# Altium project Universal_PLC.PrjPcb (part 2 of 2)

## Sheet ANALOG_IOUTPUT.SchDoc
size A4; SheetNumber: 8; SheetTotal: 17
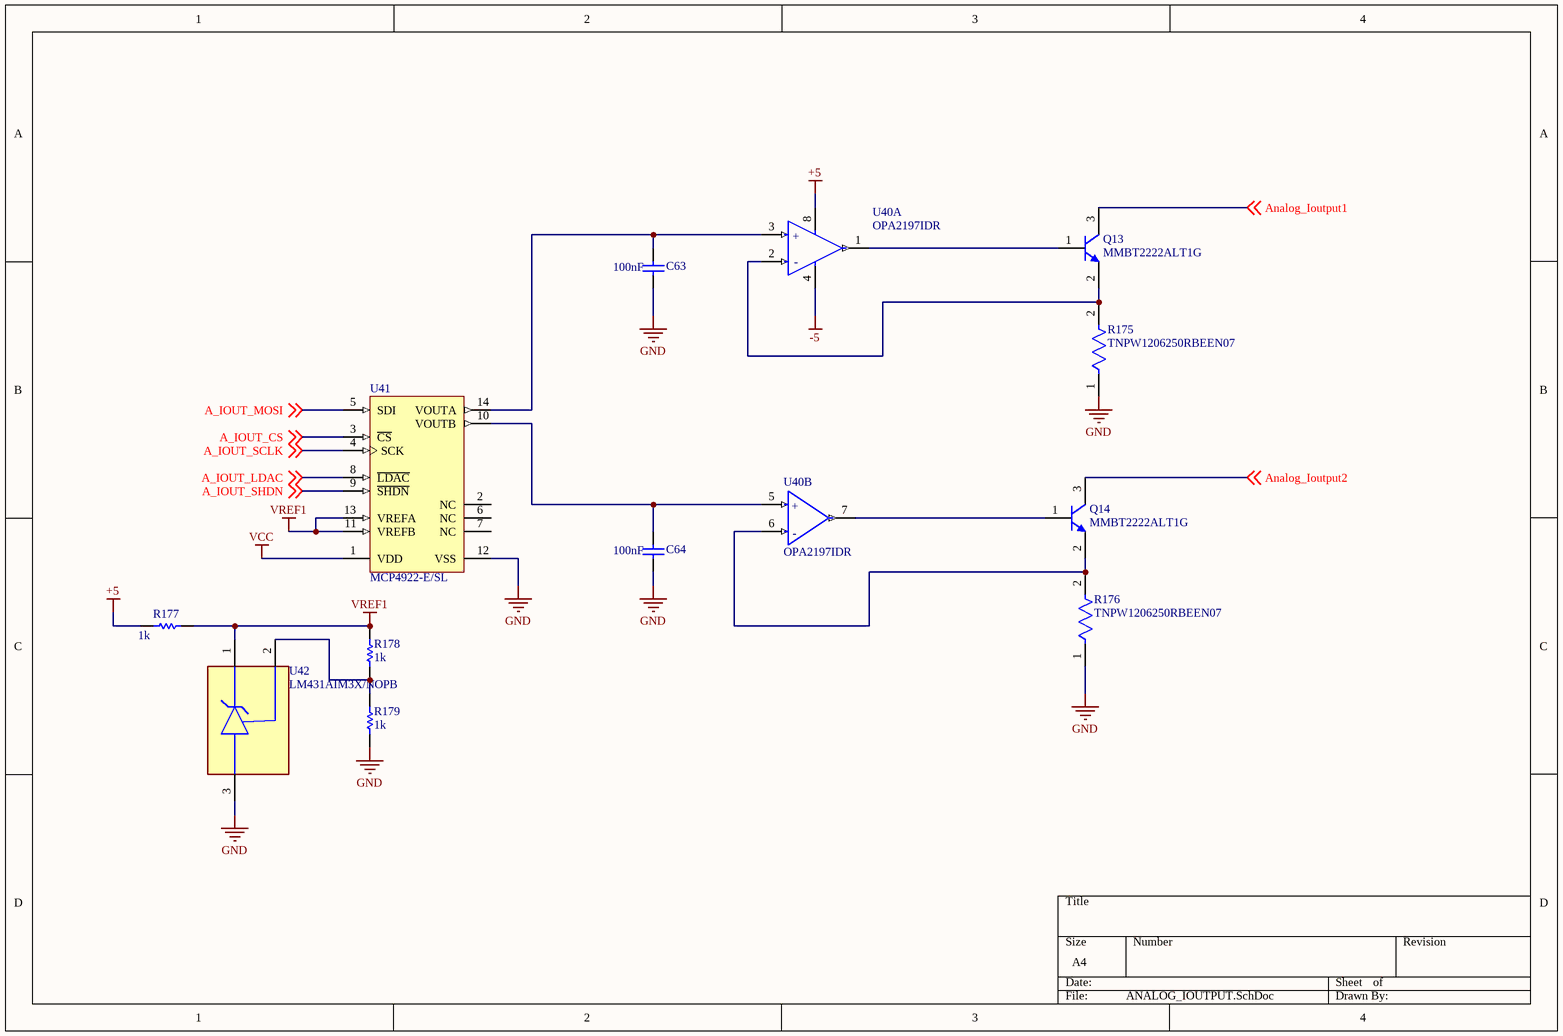
[diagram p5: ANALOG_IOUTPUT.SchDoc]

### Parts
C63  Capacitance: 100nF  [CAPC2013X135X45ML10T25]  (hidden comment: GRM21BR71H104KA01L)
C64  Capacitance: 100nF  [CAPC2013X135X45ML10T25]  (hidden comment: GRM21BR71H104KA01L)
Q13  MMBT2222ALT1G  [ONSC-SOT-23-3-318-08_V]
Q14  MMBT2222ALT1G  [ONSC-SOT-23-3-318-08_V]
R175  TNPW1206250RBEEN07  [FP-TNPW1206-e3-MFG]
R176  TNPW1206250RBEEN07  [FP-TNPW1206-e3-MFG]
R177  value 1k  [RESC2013X50X30NL20T20]  (hidden comment: CRCW08051K00FKTC)
R178  value 1k  [RESC2013X50X30NL20T20]  (hidden comment: CRCW08051K00FKTC)
R179  value 1k  [RESC2013X50X30NL20T20]  (hidden comment: CRCW08051K00FKTC)
U40  OPA2197IDR  [FP-D0008A-MFG]  (parts A,B of 2)
U41  MCP4922-E/SL  [SOIC-SL14_M]
U42  LM431AIM3X/NOPB  [FP-DBZ0003A-IPC_B]

### Nets
+5: R177.1 U40.8(V+)
-5: U40.4(V-)
GND: C63.1 C64.1 R175.1 R176.1 R179.1 U41.12(VSS) U42.3(A)
VCC: U41.1(VDD)
VREF1: R177.2 R178.2 U41.11(VREFB) U41.13(VREFA) U42.1(C)
A_IOUT_CS: U41.3(~{CS}) ; off-sheet A_IOUT_CS
A_IOUT_LDAC: U41.8(~{LDAC}) ; off-sheet A_IOUT_LDAC
A_IOUT_MOSI: U41.5(SDI) ; off-sheet A_IOUT_MOSI
A_IOUT_SCLK: U41.4(SCK) ; off-sheet A_IOUT_SCLK
A_IOUT_SHDN: U41.9(~{SHDN}) ; off-sheet A_IOUT_SHDN
Analog_Ioutput1: Q13.3(C) ; off-sheet Analog_Ioutput1
Analog_Ioutput2: Q14.3(C) ; off-sheet Analog_Ioutput2
NetC63_2: C63.2 U40.3(+IN_A) U41.14(VOUTA)
NetC64_2: C64.2 U40.5(+IN_B) U41.10(VOUTB)
NetQ13_1: Q13.1(B) U40.1(OUT_A)
NetQ13_2: Q13.2(E) R175.2 U40.2(-IN_A)
NetQ14_1: Q14.1(B) U40.7(OUT_B)
NetQ14_2: Q14.2(E) R176.2 U40.6(-IN_B)
NetR178_1: R178.1 R179.2 U42.2(REF)

Not connected (* = marked no-connect by the designer): U41 2(NC) 6(NC) 7(NC)

### Notes on the sheet
- (in symbol CMP-04895-000044-1, part A) +; -
- (in symbol CMP-04895-000044-1, part B) +; -

### Library data of the parts
C63 C64 = CMP-2100-03644-1: Chip Capacitor, 0.1 uF, +/- 10%, 50 V, -55 to 125 degC, 0805 (2012 Metric), RoHS, Tape and Reel; Manufacturer: Murata; Voltage: 50V; Insulation Resistance: 10GR; Dielectric Material: Ceramic; Dielectric: X7R; Package Description: 2-Pin Surface Mount Device, Body 2 x 1.25 mm; Manufacturer URL: http://www.murata.com/; Case Code (Imperial): 0805; Datasheet URL: http://psearch.en.murata.com/capacitor/product/GRM21BR71H104KA01%23.pdf; Termination: SMD/SMT; Lead Free: LeadFree; Package Quantity: 1; Mount: SurfaceMount; REACH SVHC: Unknown; Thickness: 0.053inch; Height: 1.25mm; Case/Package: 0805; Voltage Rating: 50V; Width: 0.049inch; Case Code (Metric): 2012; Material: Ceramic; Min Operating Temperature: -55degC; RoHSCompliant: true; Datasheet Version: 42675.0; Voltage Rating (DC): 50V; Tolerance: 10%; Package Reference: 0805; Depth: 1.25mm; Length: 2mm; Max Operating Temperature: 125degC; Packaging: TapeandReel; Number of Pins: 2; Radiation Hardening: No
Q13 Q14 = CMP-1048-00538-1: General Purpose Transistor, NPN Silicon, 3-Pin SOT-23, Pb-Free, Tape and Reel; Manufacturer: On Semiconductor; fT Min (MHz): 300; IC Continuous (A): 0.6; ComponentLink3URL: http://www.onsemi.cn/pub_link/Collateral/318-08.PDF; PartNumber: MMBT2222ALT1G; RoHS: TRUE; ComponentLink1URL: http://www.onsemi.com/; ComponentLink3Description: Package Specification; ComponentLink2Description: Datasheet; Mounting Technology: Surface Mount; Packing: Tape and Reel; PackageDescription: 3-Pin Small Outline Transistor, Body 2.92 x 1.3 mm, Pitch 0.95 mm; DatasheetVersion: Rev. 10; PackageReference: SOT-23-3-318-08; ComponentLink2URL: http://www.onsemi.cn/pub_link/Collateral/MMBT2222LT1-D.PDF; Polarity: NPN; PackageVersion: Rev. AP, 11/2009; ComponentLink1Description: Manufacturer URL
R175 R176 = CMP-02407-012799-1: Res Thnflm 1206 250R Ohm 0.1% 1/4W 25PPM/C SMD; Power Rating: 250mW; Temperature Coefficient: 25ppm/°C; Voltage Rating: 200V; Resistance: 250R; Length: 3.2mm; Package Quantity: 5000; Height: 0.55mm; Weight: 0.000571oz; Resistor Type: Thin Film; Tolerance: 0.1%; Packaging: Tape and Reel; Case/Package: 1206; Contact Plating: Tin; Min Operating Temperature: -55°C; Case Code (Imperial): 1206; Case Code (Metric): 3216; Width: 1.6mm; Termination: SMD/SMT; Series: TNPW e3; Max Operating Temperature: 125°C
R177-R179 = CMP-2001-04268-1: Manufacturer: Vishay Dale; Part Number: CRCW08051K00FKTC
U40 = CMP-04895-000044-1: IC OP AMP GP RR 10MHZ 8-SOIC; Manufacturer: Texas Instruments; Output Current Per Channel: 65mA; Min Supply Voltage: 4.5V; Input Offset Voltage: 0.025mV; Number Of Channels: 2; Voltage Gain: 134-143dB; Max Dual Supply Voltage: 18V; Min Dual Supply Voltage: 2.25V; Standoff Height: 0.11mm; Max Supply Voltage: 36V; Input Bias Current: 0.000005uA; Nominal Supply Current: 1mA; Max Junction Temp: +150°C; Temperature Range Low: -40°C; Package: D0008A; Temperature: -40°C to +125°C; Gain Bandwidth: 10MHz; Category: IC; Digikey Description: IC OP AMP GP RR 10MHZ 8-SOIC; Automotive: No; Height: 1.75mm; Ambient Temperature Range Low: -40°C; Device Class L3: Amplifiers - Op Amps; ComponentLink2URL: http://www.ti.com/lit/ds/symlink/opa2197.pdf; Lead Free: Yes; RoHS: TRUE; Manufacturer Part Number: OPA2197IDR; Device Class L1: Integrated Circuits (ICs); ComponentLink2Description: Datasheet; Ipc Land Pattern Name: SOIC127P600X175-8; Device Class L2: Linear ICs; Temperature Range High: +125°C; Octopart: https://octopart.com/opa2197idr-texas+instruments-75179702; Ambient Temperature Range High: +125°C
U41 = CMP-0188-00496-2: 12-Bit DAC with SPI Interface, 14-Pin SOIC 150mil, Extended Temperature; ComponentLink2Description: Datasheet; DatasheetVersion: revA, Apr-2010; RevisionNote: URLs added. DatasheetVersion updated. Sch updated.; Code_IPC: SOIC127P600-14; PackageVersion: revBB, Aug-2009; PackageReference: SOIC-SL14; ComponentLink3URL: http://www.microchip.com/stellent/groups/techpub_sg/documents/packagingspec/en012702.pdf; ComponentLink3Description: Package Specification; ComponentLink2URL: http://ww1.microchip.com/downloads/en/DeviceDoc/22250A.pdf; ComponentLink1URL: http://www.microchip.com/; Code_JEDEC: MS-012-AB; PackageDescription: 14-Lead Plastic Small Outline (SL) - Narrow, 3.90mm Body [SOIC]; ComponentLink1Description: Manufacturer URL
U42 = CMP-04916-000022-1: IC VREF SHUNT 37V 2.2% SOT23-3; Temperature Coefficient: 50ppm/°C; Tolerance: 2%; Max Output Current: 100mA; Cathode Current: 1mA; Number of Channels: 1; Radiation Hardening: No; Packaging: Tape and Reel; Package Quantity: 3000; Max Output Voltage: 37V; Max Input Voltage: 37V; Min Operating Temperature: -40°C; Case/Package: SOT-23; Lead Free: Lead Free; Number of Pins: 3; Output Current: 100mA; RoHS Compliant: Yes; Max Operating Temperature: 85°C; Reference Type: Shunt; Output Voltage: 37V; Mount: Surface Mount

## Sheet ANALOG_VOUTPUT.SchDoc
size A4; SheetNumber: 9; SheetTotal: 17
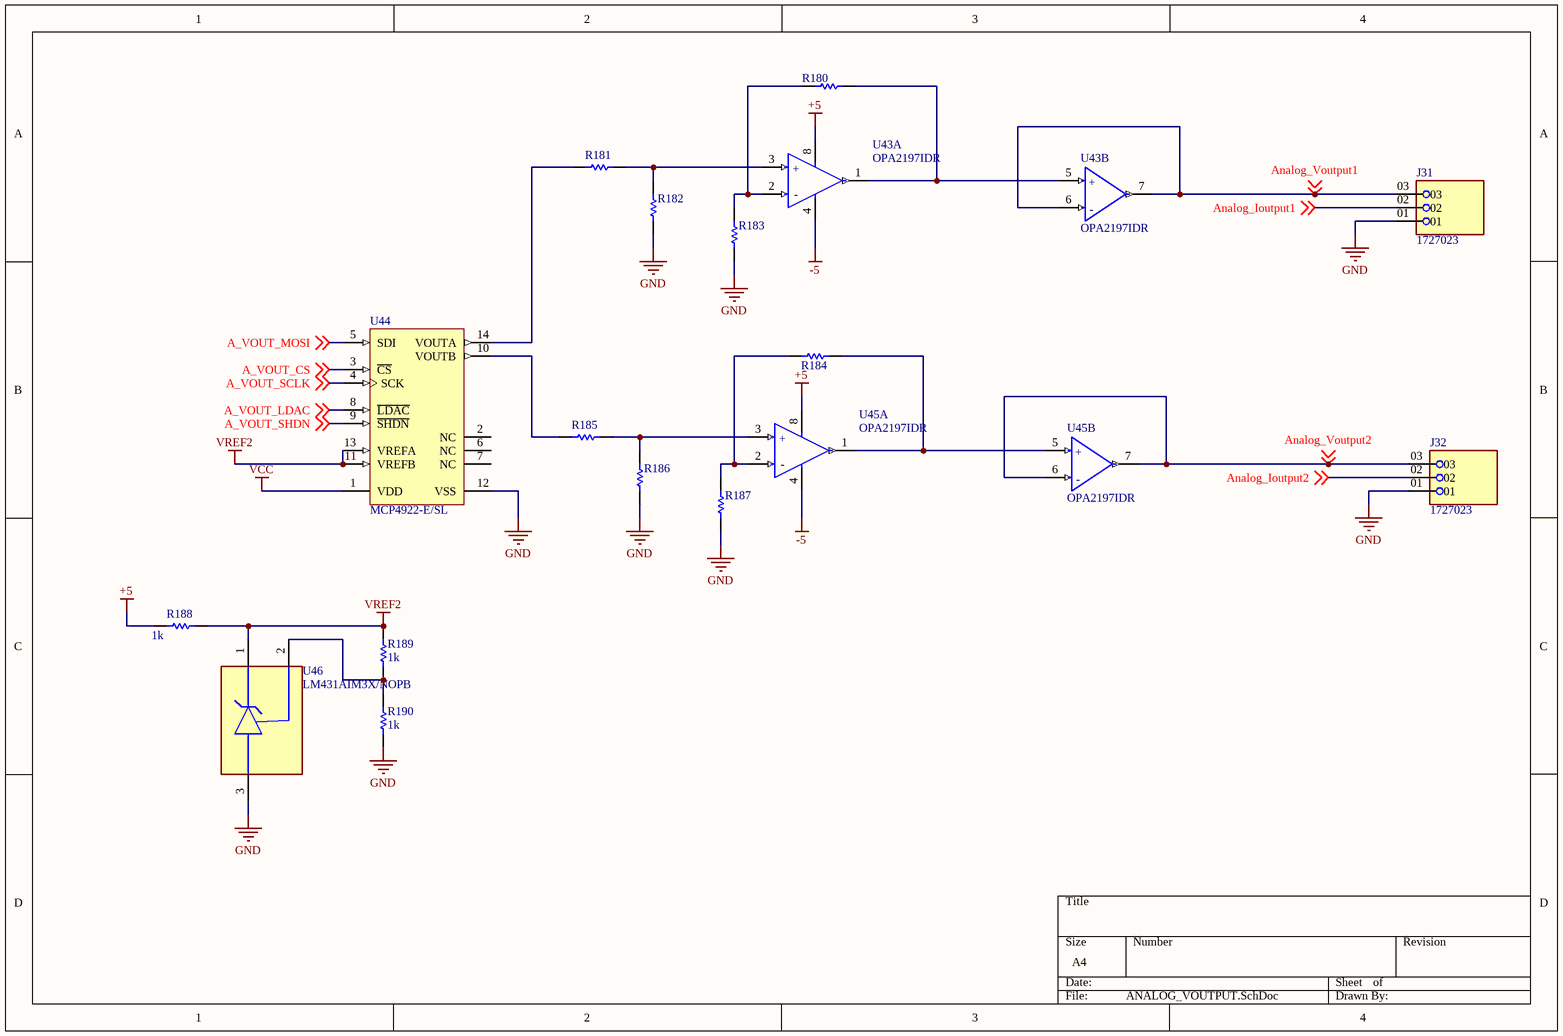
[diagram p6: ANALOG_VOUTPUT.SchDoc]

### Parts
J31  1727023  [PHOENIX_1727023]
J32  1727023  [PHOENIX_1727023]
R180  CRCW060310K0FKEA  [RESC1609X50X30NL8T20]  (value not drawn)
R181  CRCW060310K0FKEA  [RESC1609X50X30NL8T20]  (value not drawn)
R182  CRCW060310K0FKEA  [RESC1609X50X30NL8T20]  (value not drawn)
R183  CRCW060310K0FKEA  [RESC1609X50X30NL8T20]  (value not drawn)
R184  CRCW060310K0FKEA  [RESC1609X50X30NL8T20]  (value not drawn)
R185  CRCW060310K0FKEA  [RESC1609X50X30NL8T20]  (value not drawn)
R186  CRCW060310K0FKEA  [RESC1609X50X30NL8T20]  (value not drawn)
R187  CRCW060310K0FKEA  [RESC1609X50X30NL8T20]  (value not drawn)
R188  value 1k  [RESC2013X50X30NL20T20]  (hidden comment: CRCW08051K00FKTC)
R189  value 1k  [RESC2013X50X30NL20T20]  (hidden comment: CRCW08051K00FKTC)
R190  value 1k  [RESC2013X50X30NL20T20]  (hidden comment: CRCW08051K00FKTC)
U43  OPA2197IDR  [FP-D0008A-MFG]  (parts A,B of 2)
U44  MCP4922-E/SL  [SOIC-SL14_M]
U45  OPA2197IDR  [FP-D0008A-MFG]  (parts A,B of 2)
U46  LM431AIM3X/NOPB  [FP-DBZ0003A-IPC_B]

### Nets
+5: R188.1 U43.8(V+) U45.8(V+)
-5: U43.4(V-) U45.4(V-)
GND: J31.01 J32.01 R182.1 R183.1 R186.1 R187.1 R190.1 U44.12(VSS) U46.3(A)
VCC: U44.1(VDD)
VREF2: R188.2 R189.2 U44.11(VREFB) U44.13(VREFA) U46.1(C)
A_VOUT_CS: U44.3(~{CS}) ; off-sheet A_VOUT_CS
A_VOUT_LDAC: U44.8(~{LDAC}) ; off-sheet A_VOUT_LDAC
A_VOUT_MOSI: U44.5(SDI) ; off-sheet A_VOUT_MOSI
A_VOUT_SCLK: U44.4(SCK) ; off-sheet A_VOUT_SCLK
A_VOUT_SHDN: U44.9(~{SHDN}) ; off-sheet A_VOUT_SHDN
Analog_Ioutput1: J31.02 ; off-sheet Analog_Ioutput1
Analog_Ioutput2: J32.02 ; off-sheet Analog_Ioutput2
Analog_Voutput1: J31.03 U43.6(-IN_B) U43.7(OUT_B) ; off-sheet Analog_Voutput1
Analog_Voutput2: J32.03 U45.6(-IN_B) U45.7(OUT_B) ; off-sheet Analog_Voutput2
NetR180_1: R180.1 U43.1(OUT_A) U43.5(+IN_B)
NetR180_2: R180.2 R183.2 U43.2(-IN_A)
NetR181_1: R181.1 U44.14(VOUTA)
NetR181_2: R181.2 R182.2 U43.3(+IN_A)
NetR184_1: R184.1 U45.1(OUT_A) U45.5(+IN_B)
NetR184_2: R184.2 R187.2 U45.2(-IN_A)
NetR185_1: R185.1 U44.10(VOUTB)
NetR185_2: R185.2 R186.2 U45.3(+IN_A)
NetR189_1: R189.1 R190.2 U46.2(REF)

Not connected (* = marked no-connect by the designer): U44 2(NC) 6(NC) 7(NC)

### Notes on the sheet
- (in symbol CMP-04895-000044-1, part A) +; -
- (in symbol CMP-04895-000044-1, part B) +; -

### Library data of the parts
J31 J32 = 1727023: PCB Terminal Screw 3.81mm 16AWG 200V 13.5A 3 Position COMBICON MKDS Series | Phoenix Contact 1727023; SnapEDA_Link: https://www.snapeda.com/parts/1727023/Phoenix+Contact/view-part/?ref=snap; Package: None; Value: *; MF: Phoenix Contact; MP: 1727023; Check_prices: https://www.snapeda.com/parts/1727023/Phoenix+Contact/view-part/?ref=eda
R180-R187 = CMP-1666-00005-4: Chip Resistor, 10 KOhm, +/- 1%, 100 mW, -55 to 155 degC, 0603 (1608 Metric), RoHS, Tape and Reel; Manufacturer: Vishay Semiconductor; Voltage Rating: 75 V; Max Operating Temperature: 155 degC; PackageDescription: 2-Pin Surface Mount Device, Body 1.575 x 0.85 mm; ComponentLink1Description: Manufacturer URL; RoHSCompliant: true; PackageReference: 0603; REACH SVHC: Unknown; Length: 1.55 mm; DatasheetVersion: 06/2012; Packaging: Tape and Reel; Min Operating Temperature: -55 degC; Mounting Technology: Surface Mount; ComponentLink2URL: https://datasheet.ciiva.com/11809/0900766b80d98afc-11809037.pdf; Height: 0.45 mm; ComponentLink2Description: Datasheet; Package Quantity: 5000; ComponentLink1URL: http://www.vishay.com/
R188-R190 = CMP-2001-04268-1: Manufacturer: Vishay Dale; Part Number: CRCW08051K00FKTC
U43 U45 = CMP-04895-000044-1: as U40 on sheet ANALOG_IOUTPUT; Temperature Range Low: -40°C; Package: D0008A; Temperature: -40°C to +125°C; Gain Bandwidth: 10MHz; Category: IC; Digikey Description: IC OP AMP GP RR 10MHZ 8-SOIC; Automotive: No; Height: 1.75mm; Ambient Temperature Range Low: -40°C; Device Class L3: Amplifiers - Op Amps; ComponentLink2URL: http://www.ti.com/lit/ds/symlink/opa2197.pdf; Lead Free: Yes; RoHS: TRUE; Manufacturer Part Number: OPA2197IDR; Device Class L1: Integrated Circuits (ICs); ComponentLink2Description: Datasheet; Ipc Land Pattern Name: SOIC127P600X175-8; Device Class L2: Linear ICs; Temperature Range High: +125°C; Octopart: https://octopart.com/opa2197idr-texas+instruments-75179702; Ambient Temperature Range High: +125°C
U44 = CMP-0188-00496-2: as U41 on sheet ANALOG_IOUTPUT; ComponentLink2Description: Datasheet; DatasheetVersion: revA, Apr-2010; RevisionNote: URLs added. DatasheetVersion updated. Sch updated.; Code_IPC: SOIC127P600-14; PackageVersion: revBB, Aug-2009; PackageReference: SOIC-SL14; ComponentLink3URL: http://www.microchip.com/stellent/groups/techpub_sg/documents/packagingspec/en012702.pdf; ComponentLink3Description: Package Specification; ComponentLink2URL: http://ww1.microchip.com/downloads/en/DeviceDoc/22250A.pdf; ComponentLink1URL: http://www.microchip.com/; Code_JEDEC: MS-012-AB; PackageDescription: 14-Lead Plastic Small Outline (SL) - Narrow, 3.90mm Body [SOIC]; ComponentLink1Description: Manufacturer URL
U46 = CMP-04916-000022-1: as U42 on sheet ANALOG_IOUTPUT; Radiation Hardening: No; Packaging: Tape and Reel; Package Quantity: 3000; Max Output Voltage: 37V; Max Input Voltage: 37V; Min Operating Temperature: -40°C; Case/Package: SOT-23; Lead Free: Lead Free; Number of Pins: 3; Output Current: 100mA; RoHS Compliant: Yes; Max Operating Temperature: 85°C; Reference Type: Shunt; Output Voltage: 37V; Mount: Surface Mount

## Sheet Temp_sensors Input.SchDoc
size A4; SheetNumber: 10; SheetTotal: 16
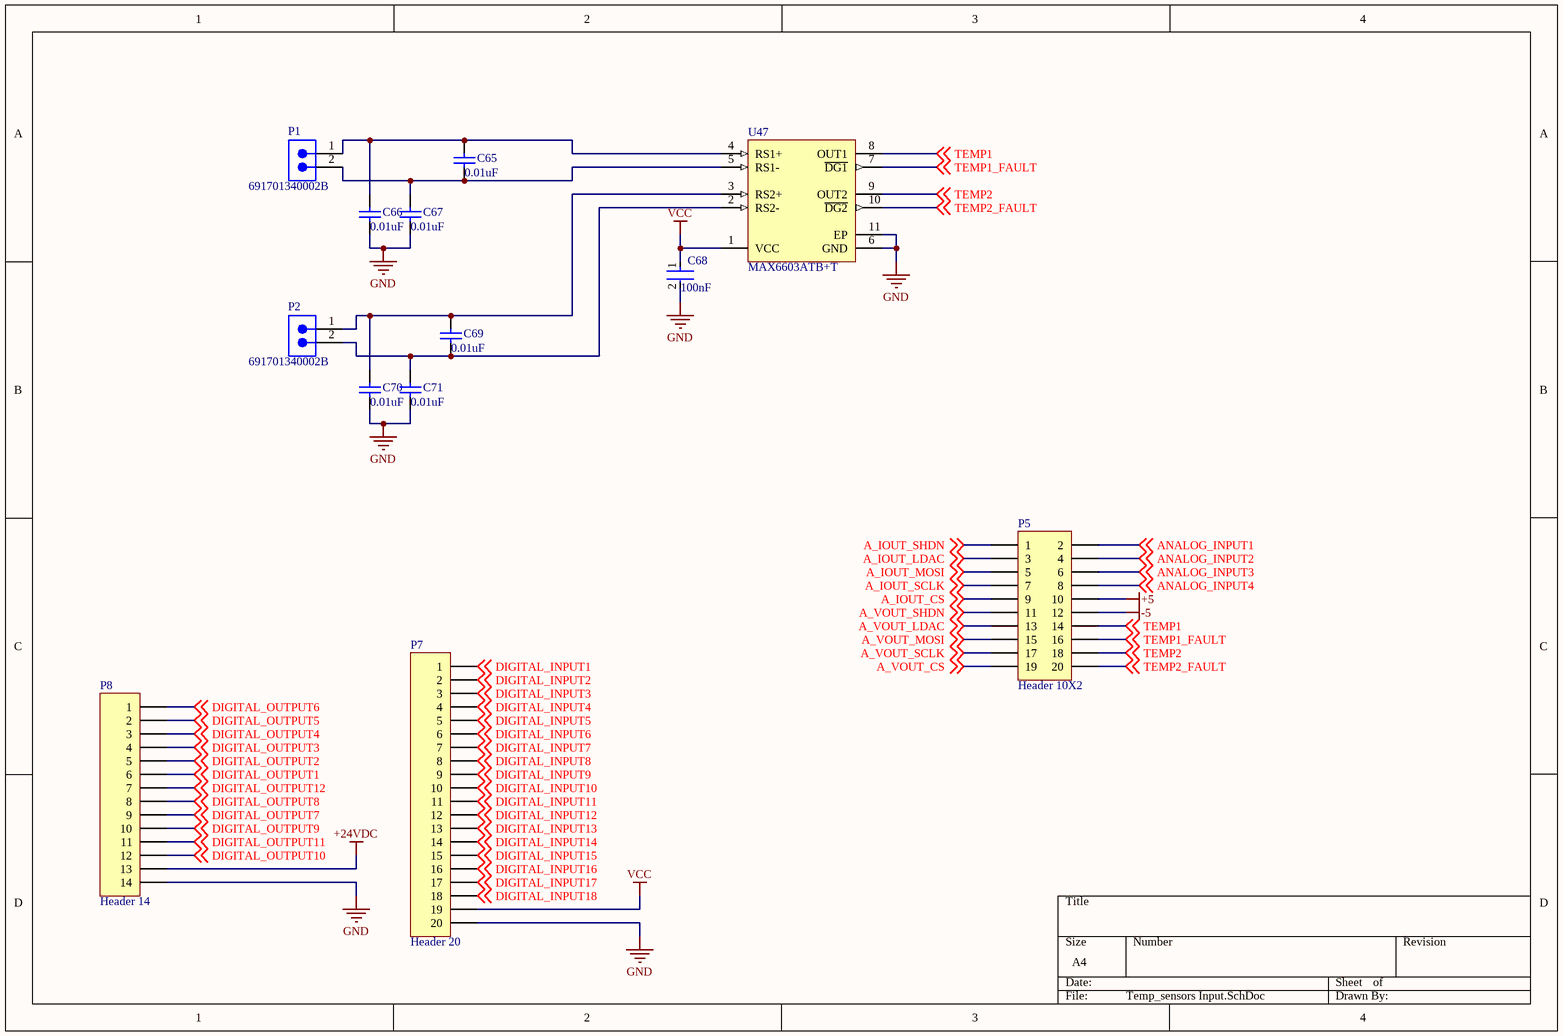
[diagram p7: Temp_sensors Input.SchDoc]

### Parts
C65  value 0.01uF  [CAPC1608X92X38ML15T08]  (hidden comment: VJ0603Y103KXAAP)
C66  value 0.01uF  [CAPC1608X92X38ML15T08]  (hidden comment: VJ0603Y103KXAAP)
C67  value 0.01uF  [CAPC1608X92X38ML15T08]  (hidden comment: VJ0603Y103KXAAP)
C68  Capacitance: 100nF  [FP-0805-L_2_01_0_2-W_1_25-IPC_B]  (hidden comment: 08051C104K4T2A)
C69  value 0.01uF  [CAPC1608X92X38ML15T08]  (hidden comment: VJ0603Y103KXAAP)
C70  value 0.01uF  [CAPC1608X92X38ML15T08]  (hidden comment: VJ0603Y103KXAAP)
C71  value 0.01uF  [CAPC1608X92X38ML15T08]  (hidden comment: VJ0603Y103KXAAP)
P1  691701340002B  [691701340002B]
P2  691701340002B  [691701340002B]
P5  Header 10X2  [HDR2X10]
P7  Header 20  [HDR1X20]
P8  Header 14  [HDR1X14]
U47  MAX6603ATB+T  [MAXM-T1033+1_V]

### Nets
+5: P5.10
+24VDC: P8.13
-5: P5.12
GND: C66.1 C67.1 C68.2 C70.1 C71.1 P7.20 P8.14 U47.6(GND) U47.11(EP)
VCC: C68.1 P7.19 U47.1(VCC)
A_IOUT_CS: P5.9 ; off-sheet A_IOUT_CS
A_IOUT_LDAC: P5.3 ; off-sheet A_IOUT_LDAC
A_IOUT_MOSI: P5.5 ; off-sheet A_IOUT_MOSI
A_IOUT_SCLK: P5.7 ; off-sheet A_IOUT_SCLK
A_IOUT_SHDN: P5.1 ; off-sheet A_IOUT_SHDN
A_VOUT_CS: P5.19 ; off-sheet A_VOUT_CS
A_VOUT_LDAC: P5.13 ; off-sheet A_VOUT_LDAC
A_VOUT_MOSI: P5.15 ; off-sheet A_VOUT_MOSI
A_VOUT_SCLK: P5.17 ; off-sheet A_VOUT_SCLK
A_VOUT_SHDN: P5.11 ; off-sheet A_VOUT_SHDN
ANALOG_INPUT1: P5.2 ; off-sheet ANALOG_INPUT1
ANALOG_INPUT2: P5.4 ; off-sheet ANALOG_INPUT2
ANALOG_INPUT3: P5.6 ; off-sheet ANALOG_INPUT3
ANALOG_INPUT4: P5.8 ; off-sheet ANALOG_INPUT4
DIGITAL_INPUT1: P7.1 ; off-sheet DIGITAL_INPUT1
DIGITAL_INPUT2: P7.2 ; off-sheet DIGITAL_INPUT2
DIGITAL_INPUT3: P7.3 ; off-sheet DIGITAL_INPUT3
DIGITAL_INPUT4: P7.4 ; off-sheet DIGITAL_INPUT4
DIGITAL_INPUT5: P7.5 ; off-sheet DIGITAL_INPUT5
DIGITAL_INPUT6: P7.6 ; off-sheet DIGITAL_INPUT6
DIGITAL_INPUT7: P7.7 ; off-sheet DIGITAL_INPUT7
DIGITAL_INPUT8: P7.8 ; off-sheet DIGITAL_INPUT8
DIGITAL_INPUT9: P7.9 ; off-sheet DIGITAL_INPUT9
DIGITAL_INPUT10: P7.10 ; off-sheet DIGITAL_INPUT10
DIGITAL_INPUT11: P7.11 ; off-sheet DIGITAL_INPUT11
DIGITAL_INPUT12: P7.12 ; off-sheet DIGITAL_INPUT12
DIGITAL_INPUT13: P7.13 ; off-sheet DIGITAL_INPUT13
DIGITAL_INPUT14: P7.14 ; off-sheet DIGITAL_INPUT14
DIGITAL_INPUT15: P7.15 ; off-sheet DIGITAL_INPUT15
DIGITAL_INPUT16: P7.16 ; off-sheet DIGITAL_INPUT16
DIGITAL_INPUT17: P7.17 ; off-sheet DIGITAL_INPUT17
DIGITAL_INPUT18: P7.18 ; off-sheet DIGITAL_INPUT18
DIGITAL_OUTPUT1: P8.6 ; off-sheet DIGITAL_OUTPUT1
DIGITAL_OUTPUT2: P8.5 ; off-sheet DIGITAL_OUTPUT2
DIGITAL_OUTPUT3: P8.4 ; off-sheet DIGITAL_OUTPUT3
DIGITAL_OUTPUT4: P8.3 ; off-sheet DIGITAL_OUTPUT4
DIGITAL_OUTPUT5: P8.2 ; off-sheet DIGITAL_OUTPUT5
DIGITAL_OUTPUT6: P8.1 ; off-sheet DIGITAL_OUTPUT6
DIGITAL_OUTPUT7: P8.9 ; off-sheet DIGITAL_OUTPUT7
DIGITAL_OUTPUT8: P8.8 ; off-sheet DIGITAL_OUTPUT8
DIGITAL_OUTPUT9: P8.10 ; off-sheet DIGITAL_OUTPUT9
DIGITAL_OUTPUT10: P8.12 ; off-sheet DIGITAL_OUTPUT10
DIGITAL_OUTPUT11: P8.11 ; off-sheet DIGITAL_OUTPUT11
DIGITAL_OUTPUT12: P8.7 ; off-sheet DIGITAL_OUTPUT12
TEMP1: P5.14 U47.8(OUT1) ; off-sheet TEMP1
TEMP1_FAULT: P5.16 U47.7(~{DG1}) ; off-sheet TEMP1_FAULT
TEMP2: P5.18 U47.9(OUT2) ; off-sheet TEMP2
TEMP2_FAULT: P5.20 U47.10(~{DG2}) ; off-sheet TEMP2_FAULT
NetC65_1: C65.1 C67.2 P1.2 U47.5(RS1-)
NetC65_2: C65.2 C66.2 P1.1 U47.4(RS1+)
NetC69_1: C69.1 C71.2 P2.2 U47.2(RS2-)
NetC69_2: C69.2 C70.2 P2.1 U47.3(RS2+)

### Library data of the parts
C65-C67 C69-C71 = CMP-2006-01149-1: Manufacturer: Vitramon; Part Number: VJ0603Y103KXAAP
C68 = CMP-2007-04172-2: Automotive Ceramic Capacitor, 0805, 100nF, 10%, X7R, 15%, 100V; Voltage Rating (DC): 100V; Case Code (Metric): 2012; Mount: Surface Mount; Length: 2.01mm; Depth: 1.25mm; Lead Free: Lead Free; Ratings: AEC-Q200; Max Operating Temperature: 125°C; Tolerance: 10%; Case/Package: 0805; Width: 0.049inch; Package Quantity: 1; Thickness: 0.055inch; Construction: Flat; Min Operating Temperature: -55°C; REACH SVHC: No SVHC; Number of Pins: 2; Radiation Hardening: No; Voltage Rating: 100V; Height: 1.4mm; Series: -; Voltage: 100V; Dielectric: X7R; Termination: SMD/SMT; Case Code (Imperial): 0805; RoHS Compliant: Yes; Packaging: Tape and Reel; Dielectric Material: Ceramic
P1 P2 = CMP-1502-02003-2: NexarPartId: 22866719; Number of Contacts: 2; Pitch: 3.81mm; Gender: Male; Voltage Rating: 300V; Connector Type: Terminal Block; Current Rating: 10A; Mount: Through Hole; Length: 9.01mm; Min Operating Temperature: -40°C; RoHS: Compliant; REACH SVHC: Unknown; Max Operating Temperature: 105°C; Contact Plating: Tin; Termination: PCB; Packaging: Tape and Reel; Contact Material: Brass; Contact Gender: Male; Lead Pitch: 3.81mm; Number of Pins: 2; Housing Material: Polymer; Color: Black
P5 = Header 10X2: Header, 10-Pin, Dual row; LatestRevisionDate: 17-Jul-2002; LatestRevisionNote: Re-released for DXP Platform.; Publisher: Altium Limited
P7 = Header 20: Header, 20-Pin; LatestRevisionDate: 17-Jul-2002; LatestRevisionNote: Re-released for DXP Platform.; Publisher: Altium Limited
P8 = Header 14: Header, 14-Pin; LatestRevisionDate: 17-Jul-2002; LatestRevisionNote: Re-released for DXP Platform.; Publisher: Altium Limited
U47 = CMP-0253-00482-1: 2-Channel Platinum RTD-to-Voltage Signal Conditioner, -40 to 125 degC, 10-Pin SON (T1033+1), Pb-Free, Tape and Reel; Parasite Pwr.: No; Functions: RTD to Voltage Signal Conditioner; Interface: Analog; Generic Part Number: MAX6603; Packing: Tape and Reel; ComponentLink1URL: http://www.maximintegrated.com/; ComponentLink3Description: Package Specification; PackageDescription: 10-Pin Plastic Very Very Thin Dual Flatpack No Leads, Exposed Pad (T1033+1), Body 3 x 3 mm, Pitch 0.5 mm; Code_JEDEC: MO229; ComponentLink1Description: Manufacturer URL; PartNumber: MAX6603ATB+T; PackageVersion: Rev. J, 08/2009; DatasheetVersion: Rev. 0; ComponentLink3URL: http://pdfserv.maximintegrated.com/package_dwgs/21-0137.PDF; Mounting Technology: Surface Mount; ComponentLink2URL: http://datasheets.maximintegrated.com/en/ds/MAX6603.pdf; ComponentLink2Description: Datasheet; PackageReference: T1033+1

## Nets that join several sheets
+5: ANALOG_IOUTPUT (R177.1 U40.8), ANALOG_VOUTPUT (R188.1 U43.8 U45.8), Temp_sensors Input (P5.10)
+24VDC: DIGITAL_OUTPUT (25 pins), DIGITAL_OUTPUT1 (24 pins), Temp_sensors Input (P8.13)
-5: ANALOG_IOUTPUT (U40.4), ANALOG_VOUTPUT (U43.4 U45.4), Temp_sensors Input (P5.12)
GND: Digital_Input (12 pins), Digital_Input2 (12 pins), Digital_Input3 (12 pins), DIGITAL_OUTPUT (31 pins), DIGITAL_OUTPUT1 (30 pins), ANALOG_IOUTPUT (7 pins), ANALOG_VOUTPUT (9 pins), Temp_sensors Input (9 pins)
VCC: Digital_Input (6 pins), Digital_Input2 (6 pins), Digital_Input3 (6 pins), ANALOG_IOUTPUT (U41.1), ANALOG_VOUTPUT (U44.1), Temp_sensors Input (C68.1 P7.19 U47.1)
A_IOUT_CS: ANALOG_IOUTPUT (U41.3), Temp_sensors Input (P5.9)
A_IOUT_LDAC: ANALOG_IOUTPUT (U41.8), Temp_sensors Input (P5.3)
A_IOUT_MOSI: ANALOG_IOUTPUT (U41.5), Temp_sensors Input (P5.5)
A_IOUT_SCLK: ANALOG_IOUTPUT (U41.4), Temp_sensors Input (P5.7)
A_IOUT_SHDN: ANALOG_IOUTPUT (U41.9), Temp_sensors Input (P5.1)
A_VOUT_CS: ANALOG_VOUTPUT (U44.3), Temp_sensors Input (P5.19)
A_VOUT_LDAC: ANALOG_VOUTPUT (U44.8), Temp_sensors Input (P5.13)
A_VOUT_MOSI: ANALOG_VOUTPUT (U44.5), Temp_sensors Input (P5.15)
A_VOUT_SCLK: ANALOG_VOUTPUT (U44.4), Temp_sensors Input (P5.17)
A_VOUT_SHDN: ANALOG_VOUTPUT (U44.9), Temp_sensors Input (P5.11)
Analog_Ioutput1: ANALOG_IOUTPUT (Q13.3), ANALOG_VOUTPUT (J31.02)
Analog_Ioutput2: ANALOG_IOUTPUT (Q14.3), ANALOG_VOUTPUT (J32.02)
DIGITAL_INPUT1: Digital_Input (R22.2), Temp_sensors Input (P7.1)
DIGITAL_INPUT2: Digital_Input (R26.2), Temp_sensors Input (P7.2)
DIGITAL_INPUT3: Digital_Input (R30.2), Temp_sensors Input (P7.3)
DIGITAL_INPUT4: Digital_Input (R34.2), Temp_sensors Input (P7.4)
DIGITAL_INPUT5: Digital_Input (R38.2), Temp_sensors Input (P7.5)
DIGITAL_INPUT6: Digital_Input (R42.2), Temp_sensors Input (P7.6)
DIGITAL_INPUT7: Digital_Input2 (R46.2), Temp_sensors Input (P7.7)
DIGITAL_INPUT8: Digital_Input2 (R50.2), Temp_sensors Input (P7.8)
DIGITAL_INPUT9: Digital_Input2 (R54.2), Temp_sensors Input (P7.9)
DIGITAL_INPUT10: Digital_Input2 (R58.2), Temp_sensors Input (P7.10)
DIGITAL_INPUT11: Digital_Input2 (R62.2), Temp_sensors Input (P7.11)
DIGITAL_INPUT12: Digital_Input2 (R66.2), Temp_sensors Input (P7.12)
DIGITAL_INPUT13: Digital_Input3 (R70.2), Temp_sensors Input (P7.13)
DIGITAL_INPUT14: Digital_Input3 (R74.2), Temp_sensors Input (P7.14)
DIGITAL_INPUT15: Digital_Input3 (R78.2), Temp_sensors Input (P7.15)
DIGITAL_INPUT16: Digital_Input3 (R82.2), Temp_sensors Input (P7.16)
DIGITAL_INPUT17: Digital_Input3 (R86.2), Temp_sensors Input (P7.17)
DIGITAL_INPUT18: Digital_Input3 (R90.2), Temp_sensors Input (P7.18)
DIGITAL_OUTPUT1: DIGITAL_OUTPUT (R97.1), Temp_sensors Input (P8.6)
DIGITAL_OUTPUT2: DIGITAL_OUTPUT (R107.1), Temp_sensors Input (P8.5)
DIGITAL_OUTPUT3: DIGITAL_OUTPUT (R115.1), Temp_sensors Input (P8.4)
DIGITAL_OUTPUT4: DIGITAL_OUTPUT (R95.1), Temp_sensors Input (P8.3)
DIGITAL_OUTPUT5: DIGITAL_OUTPUT (R105.1), Temp_sensors Input (P8.2)
DIGITAL_OUTPUT6: DIGITAL_OUTPUT (R117.1), Temp_sensors Input (P8.1)
DIGITAL_OUTPUT7: DIGITAL_OUTPUT1 (R125.1), Temp_sensors Input (P8.9)
DIGITAL_OUTPUT8: DIGITAL_OUTPUT1 (R135.1), Temp_sensors Input (P8.8)
DIGITAL_OUTPUT9: DIGITAL_OUTPUT1 (R145.1), Temp_sensors Input (P8.10)
DIGITAL_OUTPUT10: DIGITAL_OUTPUT1 (R127.1), Temp_sensors Input (P8.12)
DIGITAL_OUTPUT11: DIGITAL_OUTPUT1 (R137.1), Temp_sensors Input (P8.11)
DIGITAL_OUTPUT12: DIGITAL_OUTPUT1 (R147.1), Temp_sensors Input (P8.7)